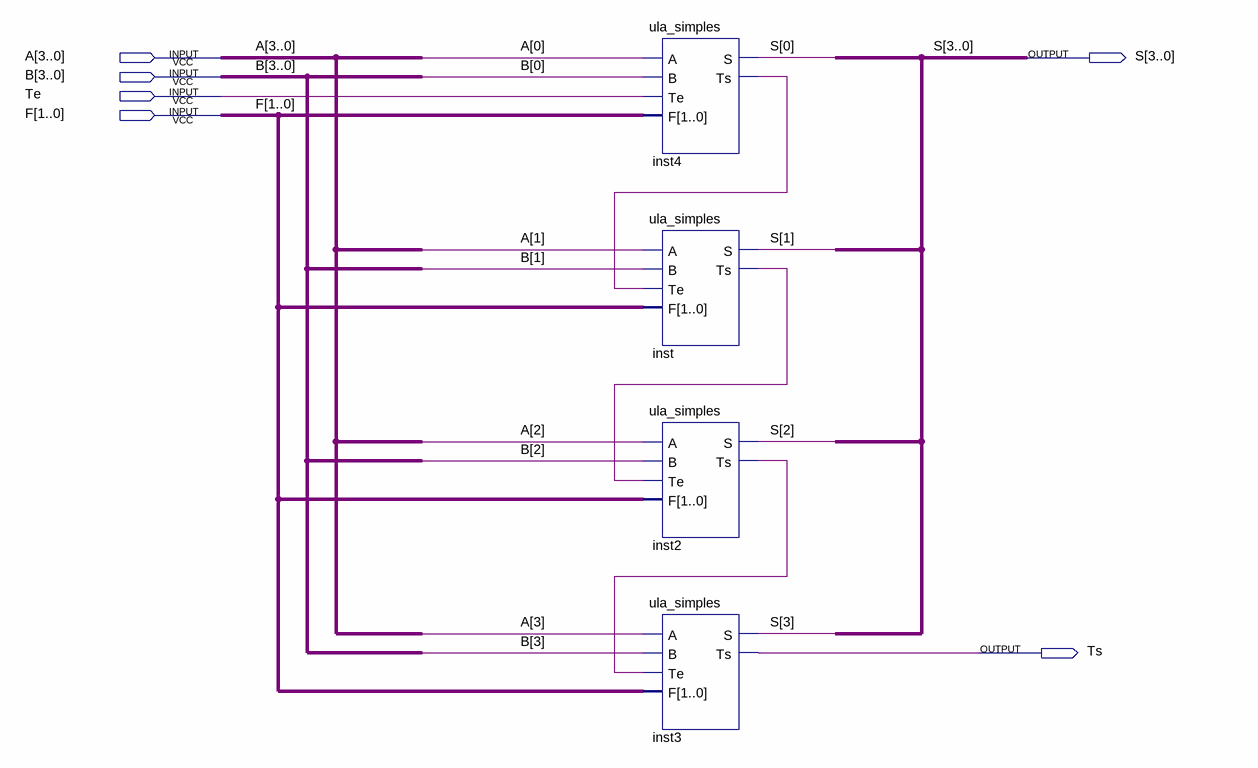
[diagram p0: schematic sheet]
// Quartus schematic ula_4bits.bdf as structural Verilog: 4 symbols, 6 pins
module ula_4bits (
  input  [3:0] A,
  input  [3:0] B,
  input  Te,
  input  [1:0] F,
  output [3:0] S,
  output Ts
);

  wire inst2_ts, inst4_ts, inst_ts;

  ula_simples inst4 (.A(A[0]), .B(B[0]), .Te(Te), .F(F), .S(S[0]), .Ts(inst4_ts));
  ula_simples inst (.A(A[1]), .B(B[1]), .Te(inst4_ts), .F(F), .S(S[1]), .Ts(inst_ts));
  ula_simples inst2 (.A(A[2]), .B(B[2]), .Te(inst_ts), .F(F), .S(S[2]), .Ts(inst2_ts));
  ula_simples inst3 (.A(A[3]), .B(B[3]), .Te(inst2_ts), .F(F), .S(S[3]), .Ts(Ts));
endmodule
